# Altium schematic sheet mimo.SchDoc
size A
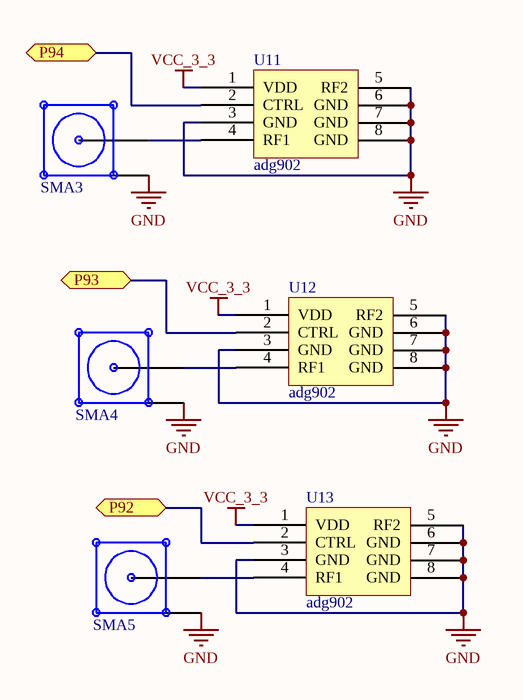
[diagram p0: mimo.SchDoc]

## Parts
SMA3  SMA - Hole - 5 Pin  [SMA - Hole - 5 Pin]  (value not drawn)
SMA4  SMA - Hole - 5 Pin  [SMA - Hole - 5 Pin]  (value not drawn)
SMA5  SMA - Hole - 5 Pin  [SMA - Hole - 5 Pin]  (value not drawn)
U11  adg902  [ADG902]
U12  adg902  [ADG902]
U13  adg902  [ADG902]

## Ports
P92, P93, P94

## Nets
GND: SMA3.1 SMA4.1 SMA5.1 U11.3(GND) U11.5(RF2) U11.6(GND) U11.7(GND) U11.8(GND) U12.3(GND) U12.5(RF2) U12.6(GND) U12.7(GND) U12.8(GND) U13.3(GND) U13.5(RF2) U13.6(GND) U13.7(GND) U13.8(GND)
VCC_3_3: U11.1(VDD) U12.1(VDD) U13.1(VDD)
P92: U13.2(CTRL) ; port P92
P93: U12.2(CTRL) ; port P93
P94: U11.2(CTRL) ; port P94
NetSMA3_2: SMA3.2 U11.4(RF1)
NetSMA4_2: SMA4.2 U12.4(RF1)
NetSMA5_2: SMA5.2 U13.4(RF1)

## Library data of the parts
SMA3-SMA5 = SMA - Hole - 5 Pin: SMA - Through Hole Connector; Manufacturer Part Number: *; Manufacturer: *; Digi-Key Part Number: *; Note: *